# EAGLE design PGTN021_octasource_mkiii_panel (EAGLE 9.6.0)
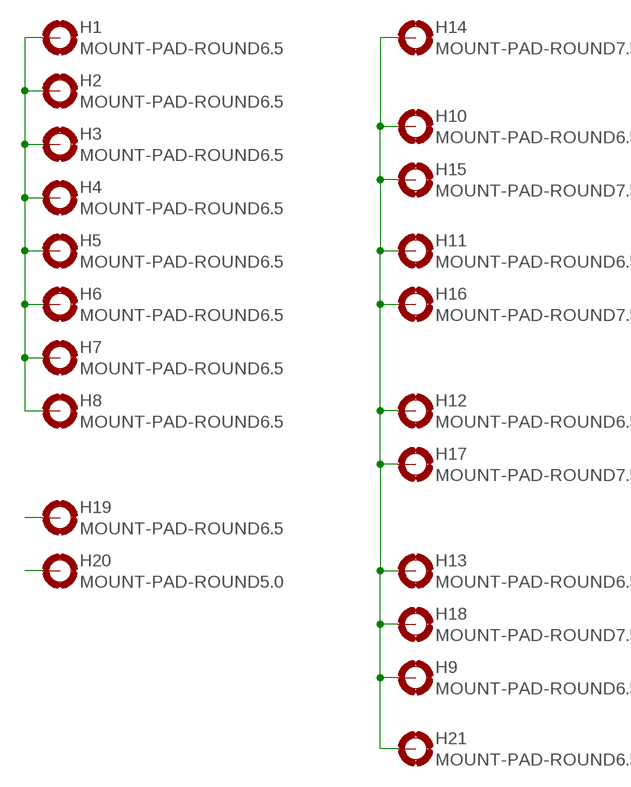
[diagram p0: schematic, sheet 1]

## Parts
H1  MOUNT-PAD-ROUND6.5  [6.5-PAD]
H2  MOUNT-PAD-ROUND6.5  [6.5-PAD]
H3  MOUNT-PAD-ROUND6.5  [6.5-PAD]
H4  MOUNT-PAD-ROUND6.5  [6.5-PAD]
H5  MOUNT-PAD-ROUND6.5  [6.5-PAD]
H6  MOUNT-PAD-ROUND6.5  [6.5-PAD]
H7  MOUNT-PAD-ROUND6.5  [6.5-PAD]
H8  MOUNT-PAD-ROUND6.5  [6.5-PAD]
H9  MOUNT-PAD-ROUND6.5  [6.5-PAD]
H10  MOUNT-PAD-ROUND6.5  [6.5-PAD]
H11  MOUNT-PAD-ROUND6.5  [6.5-PAD]
H12  MOUNT-PAD-ROUND6.5  [6.5-PAD]
H13  MOUNT-PAD-ROUND6.5  [6.5-PAD]
H14  MOUNT-PAD-ROUND7.5  [7.5-PAD]
H15  MOUNT-PAD-ROUND7.5  [7.5-PAD]
H16  MOUNT-PAD-ROUND7.5  [7.5-PAD]
H17  MOUNT-PAD-ROUND7.5  [7.5-PAD]
H18  MOUNT-PAD-ROUND7.5  [7.5-PAD]
H19  MOUNT-PAD-ROUND6.5  [6.5-PAD]
H20  MOUNT-PAD-ROUND5.0  [5,0-PAD]
H21  MOUNT-PAD-ROUND6.5  [6.5-PAD]

## Nets
N$1: H9.B6.5(MOUNT) H10.B6.5(MOUNT) H11.B6.5(MOUNT) H12.B6.5(MOUNT) H13.B6.5(MOUNT) H14.B7.5(MOUNT) H15.B7.5(MOUNT) H16.B7.5(MOUNT) H17.B7.5(MOUNT) H18.B7.5(MOUNT) H21.B6.5(MOUNT)
N$2: H1.B6.5(MOUNT) H2.B6.5(MOUNT) H3.B6.5(MOUNT) H4.B6.5(MOUNT) H5.B6.5(MOUNT) H6.B6.5(MOUNT) H7.B6.5(MOUNT) H8.B6.5(MOUNT)
N$3: H19.B6.5(MOUNT)
N$4: H20.B5(MOUNT)

## Library data of the parts
H1-H21 = holes:MOUNT-PAD-ROUND: MOUNTING PAD, round

## Board
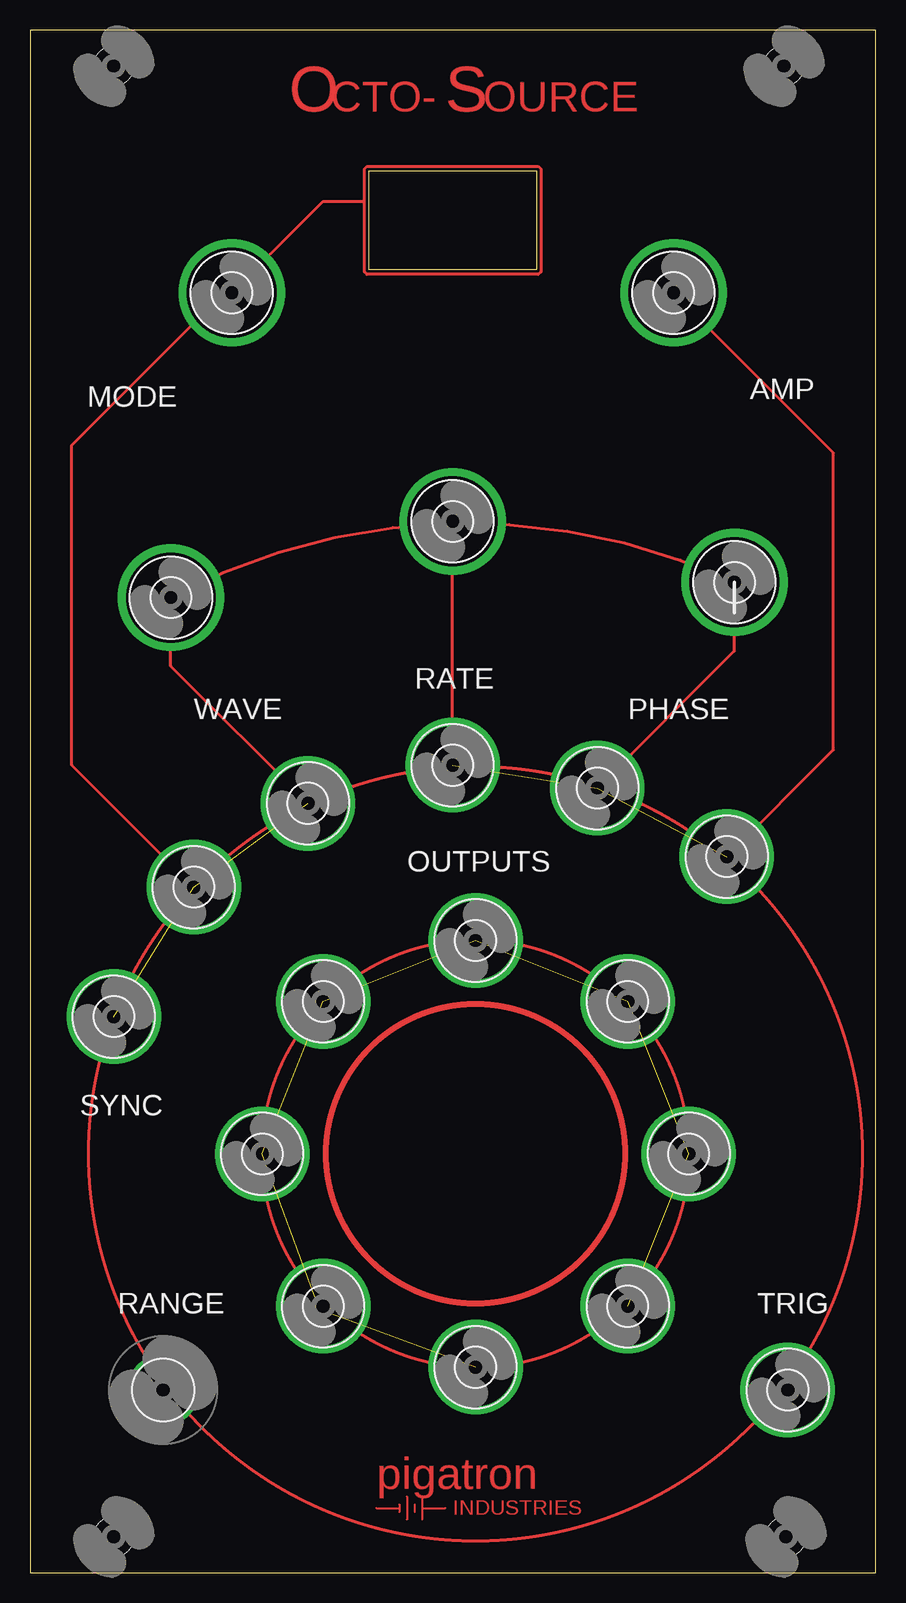
[diagram p1: board, top side]

Size 70.54 x 128.58 mm. Coordinates in mm from the lower left corner, seen from the top.
Outline: 0,0 70.54,0 70.54,128.58 0,128.58 0,0
Outline: 28.26,116.84 42.23,116.84 42.23,108.58 28.26,108.58 28.26,116.84
Copper layers (1*16): Top 0.0356mm / dielectric 1.5011mm / Bottom 0.0356mm
Design rules "pigatron *": minimum track width 5mil, minimum drill 13mil, track to track 8mil, track to pad 8mil, pad to pad 8mil, via to via 8mil, smd to smd 6mil, copper to edge 10mil, drill to drill 10mil, minimum pad ring 6mil, minimum via ring 10mil, stop-mask expansion 4mil, vias tented up to drill 15mil, thermal gap 10mil

### Footprints (pad centres in the part's own frame; a part is rotated, then mirrored left to right if it is on the bottom)
6.5-PAD = drill 6.502 pad 7.874: B6.5 0,0
7.5-PAD = drill 7.493 pad 8.89: B7.5 0,0
5,0-PAD = drill 5 pad 5.588: B5 0,0
3,3 = hole 3.3: 0,0

### Placement (x,y rotation side)
H1  37.15,52.7 0 top
H2  49.85,47.62 0 top
H3  54.93,34.92 0 top
H4  49.85,22.23 0 top
H5  37.15,17.15 0 top
H6  24.45,22.23 0 top
H7  19.37,34.92 0 top
H8  24.45,47.62 0 top
H9  13.65,57.15 0 top
H10  23.18,64.13 0 top
H11  35.24,67.31 0 top
H12  47.31,65.41 0 top
H13  58.1,59.69 0 top
H14  11.75,81.28 0 top
H15  35.24,87.63 0 top
H16  58.74,82.55 0 top
H17  53.66,106.68 0 top
H18  16.83,106.68 0 top
H19  63.18,15.24 0 top
H20  11.11,15.24 0 top
H21  6.99,46.36 0 top
U$1  [3,3]  62.87,125.57 0 top
U$2  [PIGATRON-LOGO-TRACE]  37.78,6.99 0 top
U$3  [3,3]  6.99,125.57 0 top
U$4  [3,3]  63.02,3.02 0 top
U$5  [3,3]  6.99,3.02 0 top

### Tracks (layer width: path | path; a pad name or v marks a point on that pad's centre or on a via)
N$1  (4 unrouted)
  Top 0.254: 27.88,114.3 24.45,114.3 H18.B7.5 16.19,106.68 3.49,93.98 3.49,67.31 H9.B6.5 | 27.88,114.3 27.88,117 28.1,117.22 42.39,117.22 42.61,117 42.61,108.43 42.39,108.2 28.1,108.2 27.88,108.43 27.88,114.3 | H17.B7.5 66.99,93.34 66.99,68.58 H13.B6.5 | H12.B6.5 58.74,76.83 H16.B7.5 arc53 H14.B7.5 11.75,75.56 H10.B6.5 | H11.B6.5 H15.B7.5
N$2  (7 unrouted)
  Top 0.305: 25.06,21.61 H6.B6.5 23.83,22.84
(copper drawn outside any net)
  shapes: Top circle x3

### Text on the board
Top: O | CTO- | S | OURCE
tNames: AMP | MODE | RATE | WAVE | PHASE | OUTPUTS | SYNC | RANGE | TRIG
bNames: JLCJLCJLCJLC
tStop: O | CTO- | S | OURCE